# EAGLE design MCC8 (EAGLE 6.4)
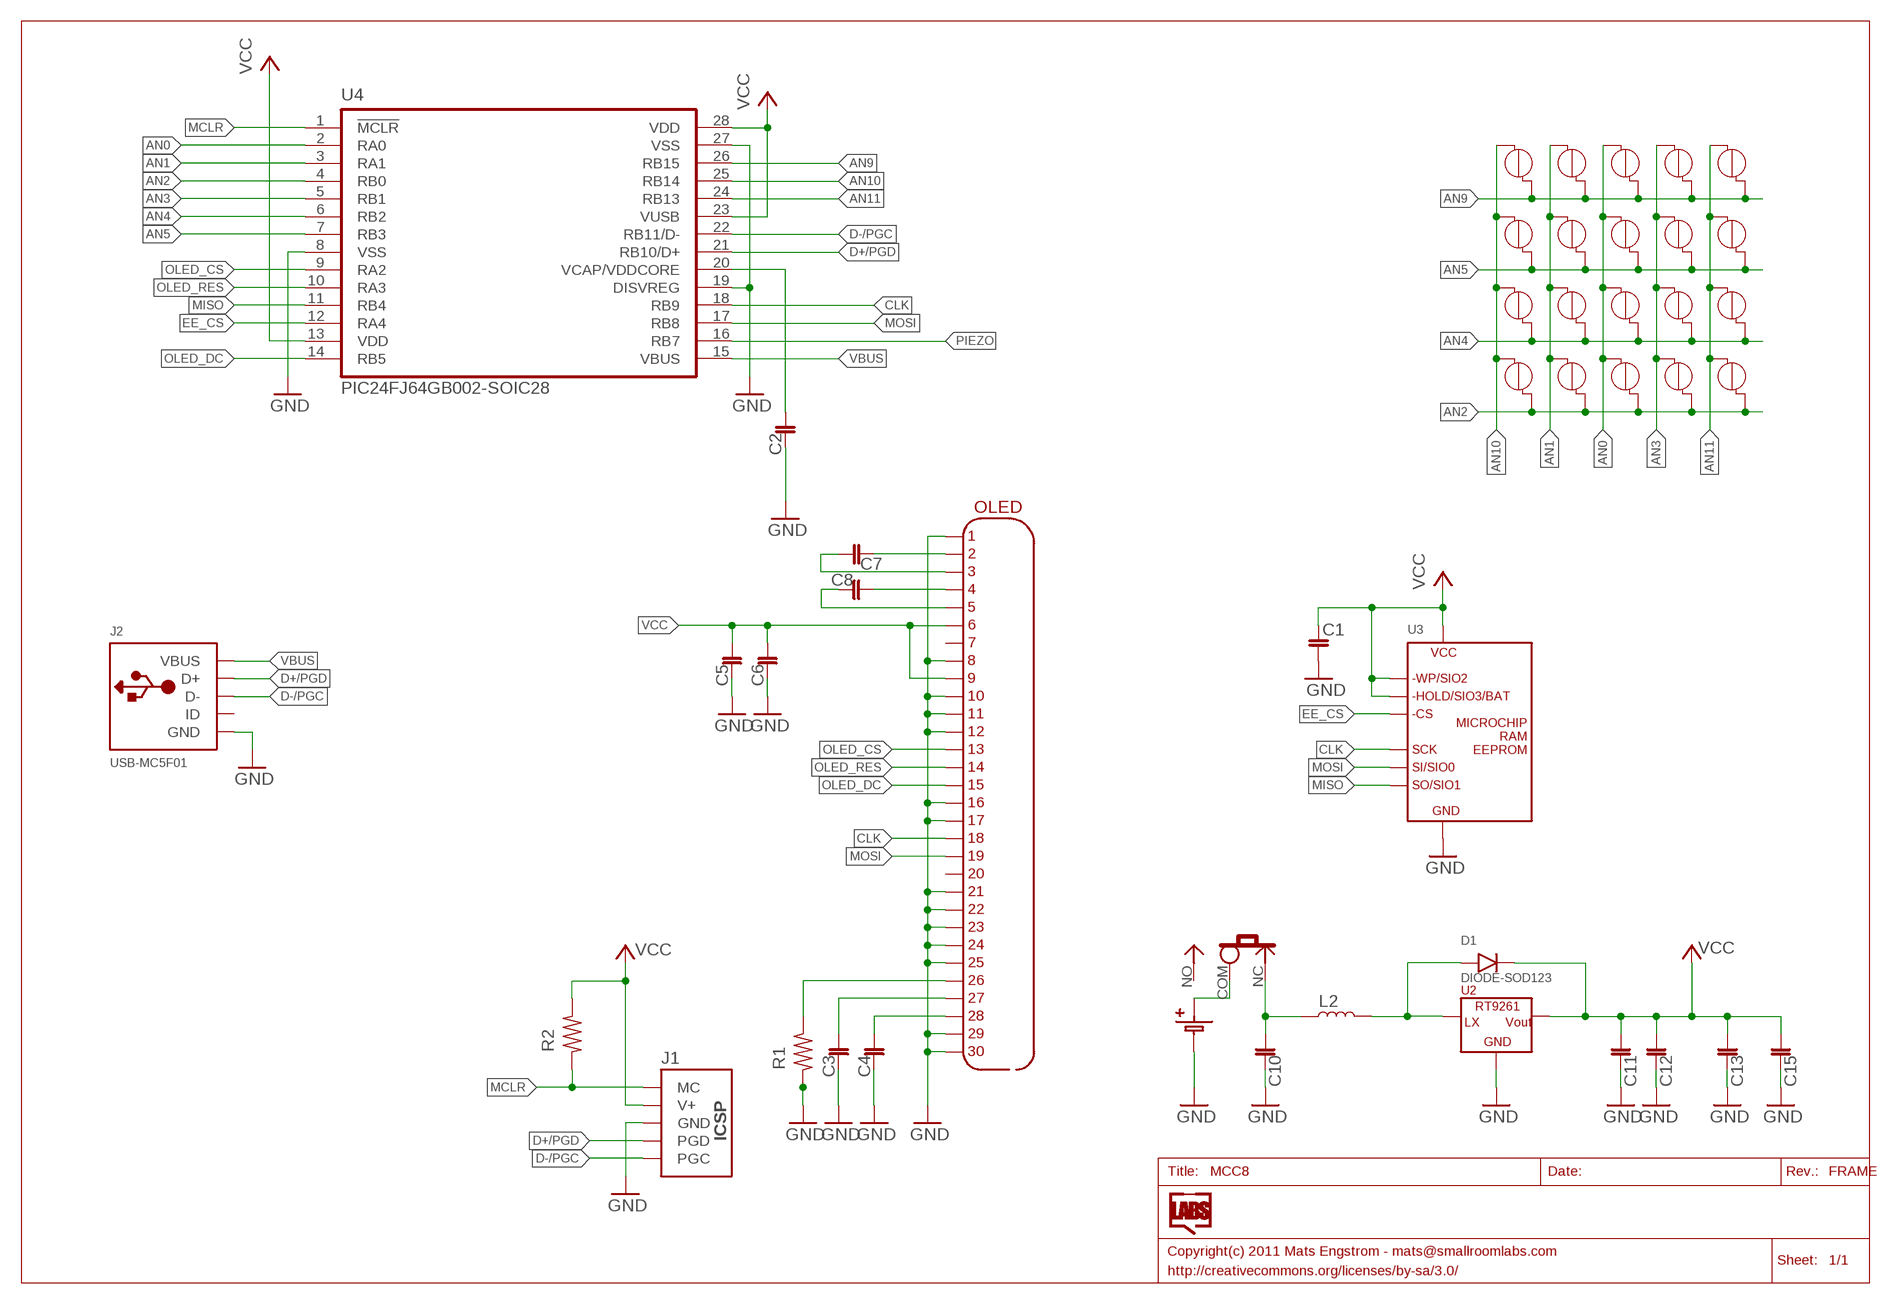
[diagram p0: schematic, sheet 1]

## Parts
B1  TOUCH-CAP2-7  [TOUCH-CAP2-7MM]
B2  TOUCH-CAP2-7  [TOUCH-CAP2-7MM]
B3  TOUCH-CAP2-7  [TOUCH-CAP2-7MM]
B4  TOUCH-CAP2-7  [TOUCH-CAP2-7MM]
B5  TOUCH-CAP2-7  [TOUCH-CAP2-7MM]
B6  TOUCH-CAP2-7  [TOUCH-CAP2-7MM]
B7  TOUCH-CAP2-7  [TOUCH-CAP2-7MM]
B8  TOUCH-CAP2-7  [TOUCH-CAP2-7MM]
B9  TOUCH-CAP2-7  [TOUCH-CAP2-7MM]
B10  TOUCH-CAP2-7  [TOUCH-CAP2-7MM]
B11  TOUCH-CAP2-7  [TOUCH-CAP2-7MM]
B12  TOUCH-CAP2-7  [TOUCH-CAP2-7MM]
B13  TOUCH-CAP2-7  [TOUCH-CAP2-7MM]
B14  TOUCH-CAP2-7  [TOUCH-CAP2-7MM]
B15  TOUCH-CAP2-7  [TOUCH-CAP2-7MM]
B16  TOUCH-CAP2-7  [TOUCH-CAP2-7MM]
B17  TOUCH-CAP2-7  [TOUCH-CAP2-7MM]
B18  TOUCH-CAP2-7  [TOUCH-CAP2-7MM]
B19  TOUCH-CAP2-7  [TOUCH-CAP2-7MM]
B20  TOUCH-CAP2-7  [TOUCH-CAP2-7MM]
BA2  BATTERY2-AAA1  [BAT-AAA1]
C1  C-0805  [C0805]
C2  C-0805  [C0805]
C3  C-0805  [C0805]
C4  C-0805  [C0805]
C5  C-0805  [C0805]
C6  C-0805  [C0805]
C7  C-0805  [C0805]
C8  C-0805  [C0805]
C10  C-0805  [C0805]
C11  C-0805  [C0805]
C12  C-0805  [C0805]
C13  C-0805  [C0805]
C15  C-0805  [C0805]
D1  DIODE-SOD123  [SOD123]
J1  ICSP-SMD-B  [ICSP-SMD-B]
J2  USB-MC5F01  [USB-MICRO-MC5F01]
L2  L-BOURNS-SRP7030  [IND-BOURNS-SRP7030]
R1  R-0805  [R0805]
R2  R-0805  [R0805]
SW1  SLIDE1-PCM12  [SW-PCM12]
U2  RT9261-SOT89  [SOT89]
U3  MICROCHIP-SERIALMEM8  [SO08]
U4  PIC24FJ64GB002-SOIC28  [SO28W]
U$2  OLED30-A  [OLED128X64]

## Nets
AN0: B9.P$1 B10.P$1 B11.P$1 B12.P$1 U4.2(RA0)
AN1: B5.P$1 B6.P$1 B7.P$1 B8.P$1 U4.3(RA1)
AN2: B4.P$2 B8.P$2 B12.P$2 B16.P$2 B20.P$2 U4.4(RB0)
AN3: B13.P$1 B14.P$1 B15.P$1 B16.P$1 U4.5(RB1)
AN4: B3.P$2 B7.P$2 B11.P$2 B15.P$2 B19.P$2 U4.6(RB2)
AN5: B2.P$2 B6.P$2 B10.P$2 B14.P$2 B18.P$2 U4.7(RB3)
AN9: B1.P$2 B5.P$2 B9.P$2 B13.P$2 B17.P$2 U4.26(RB15)
AN10: B1.P$1 B2.P$1 B3.P$1 B4.P$1 U4.25(RB14)
AN11: B17.P$1 B18.P$1 B19.P$1 B20.P$1 U4.24(RB13)
BAT: BA2.PLUS(POS1) SW1.COM
BAT-SWITCHED: C10.1 L2.P$1 SW1.NC
CLK: U3.6(SCK) U4.18(RB9) U$2.P$18
D+/PGD: J1.PGD J2.P3(D+) U4.21(RB10/D+)
D-/PGC: J1.PGC J2.P2(D-) U4.22(RB11/D-)
EE_CS: U3.1(CS) U4.12(RA4)
GND: BA2.MINUS(NEG) C1.2 C2.2 C3.2 C4.2 C5.2 C6.2 C10.2 C11.2 C12.2 C13.2 C15.2 J1.GND J2.P5(GND) R1.1 U2.1(GND) U3.4(GROUND) U4.8(VSS) U4.19(DISVREG) U4.27(VSS) U$2.P$1 U$2.P$8 U$2.P$10 U$2.P$11 U$2.P$12 U$2.P$16 U$2.P$17 U$2.P$21 U$2.P$22 U$2.P$23 U$2.P$24 U$2.P$25 U$2.P$29 U$2.P$30
LX: D1.A L2.P$2 U2.3(LX)
MCLR: J1.VPP(MC) R2.1 U4.1(!MCLR)
MISO: U3.2(SO) U4.11(RB4)
MOSI: U3.5(SI) U4.17(RB8) U$2.P$19
N$1: C4.1 U$2.P$28
N$10: C3.1 U$2.P$27
N$11: R1.2 U$2.P$26
N$12: C7.2 U$2.P$2
N$13: C7.1 U$2.P$3
N$14: C8.1 U$2.P$4
N$15: C8.2 U$2.P$5
OLED_CS: U4.9(RA2) U$2.P$13
OLED_DC: U4.14(RB5) U$2.P$15
OLED_RES: U4.10(RA3) U$2.P$14
PIEZO: U4.16(RB7)
VBUS: J2.P1(VBUS) U4.15(VBUS)
VCC: C1.1 C5.1 C6.1 C11.1 C12.1 C13.1 C15.1 D1.C J1.V+ R2.2 U2.2(VOUT) U2.2@1(VOUT) U3.3(WP) U3.7(HOLD) U3.8(POW) U4.13(VDD) U4.23(VUSB) U4.28(VDD) U$2.P$6 U$2.P$9
VDDCORE: C2.1 U4.20(VCAP/VDDCORE)
Unconnected: J2.P4(ID) SW1.NO U$2.P$7 U$2.P$20

## Library data of the parts
B1-B20 = SRL:TOUCH-CAP2
BA2 = SRL:BATTERY2
C1-C8 C10-C13 C15 = SRL:C: Not verified
D1 = SRL:DIODE
J1 = SRL:ICSP
J2 = SRL:USB
L2 = SRL:L: Not verified
R1 R2 = SRL:R: Not Verified
SW1 = SRL:SLIDE1
U2 = SRL:RT9261
U3 = SRL:MICROCHIP-SERIALMEM8
U4 = SRL:PIC24FJ64GB002
U$2 = SRL:OLED30

## Board
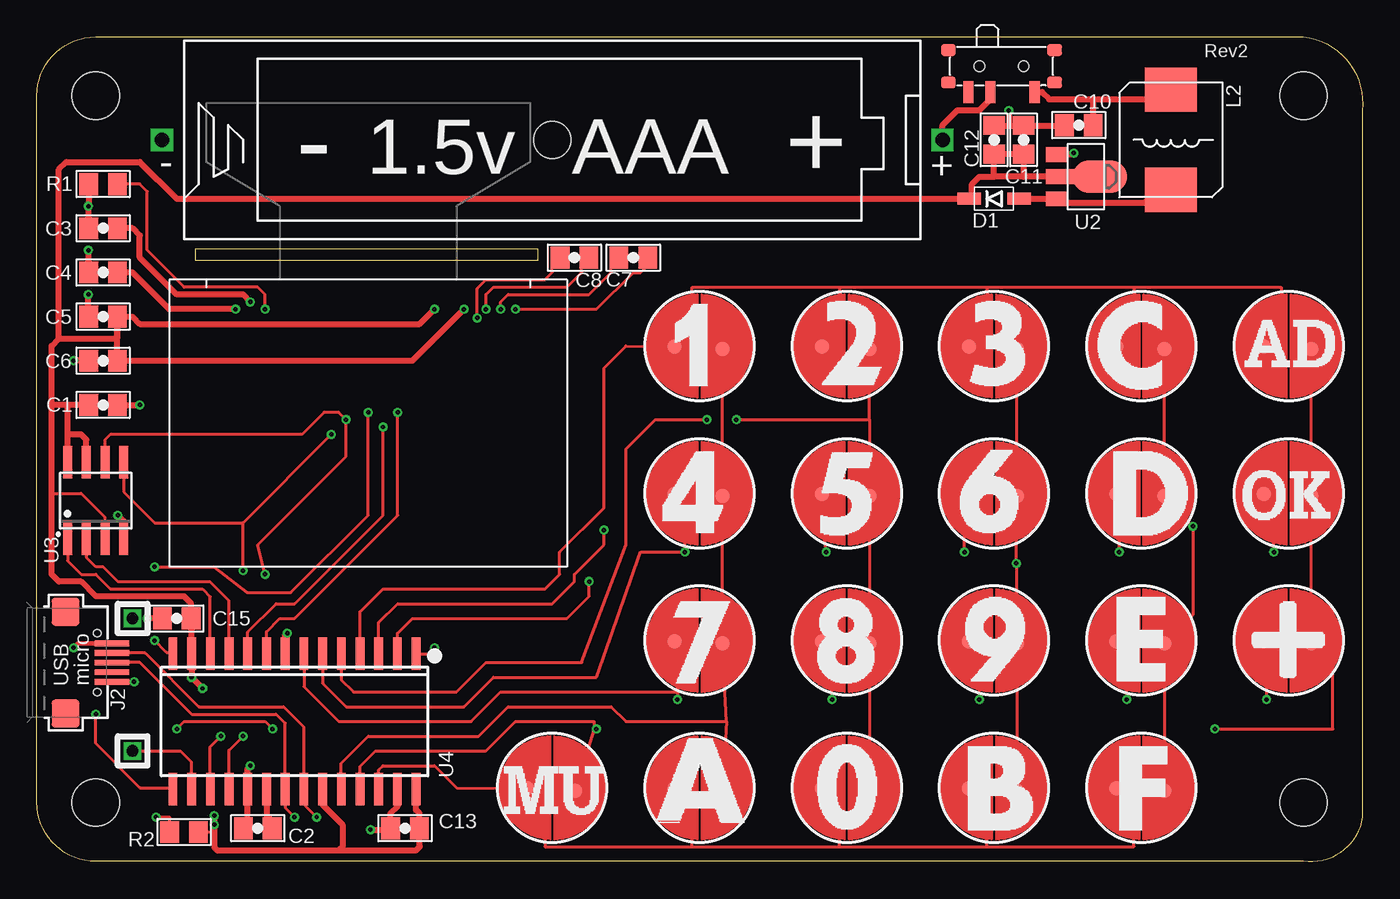
[diagram p1: board, top side]
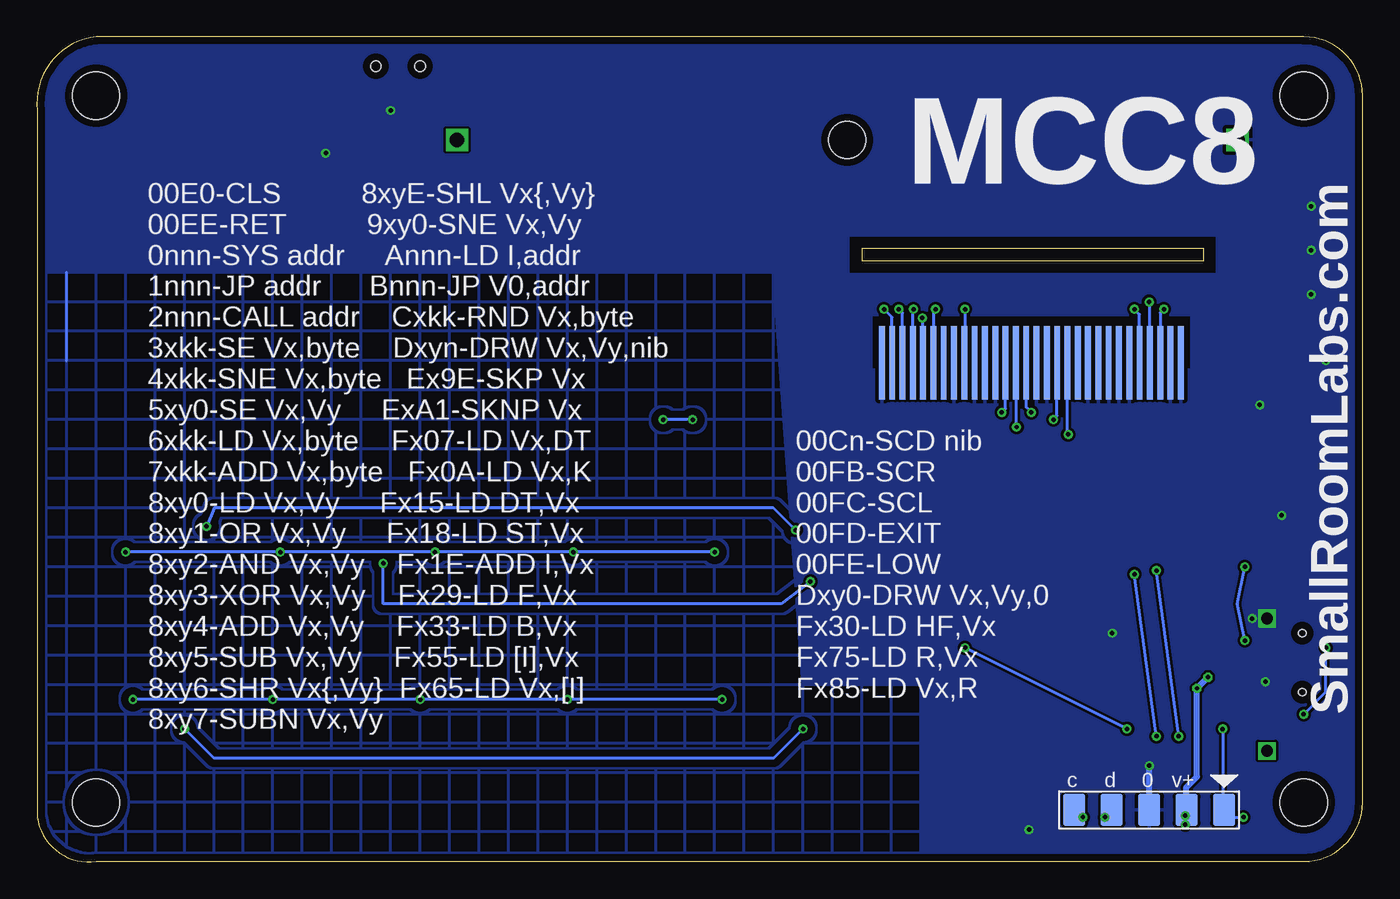
[diagram p2: board, bottom side, seen from below]

Size 90.03 x 56.03 mm. Coordinates in mm from the lower left corner, seen from the top.
Outline: 90,3.03 arc-90 86,0.03 4,0.03 arc-90 0,4.03 0,52.03 arc-90 4,56.03 86,56.03 arc-90 90,51.03 90,3.03
Copper layers (1*16): Top 0.035mm / dielectric 1.5mm / Bottom 0.035mm
Design rules "SmartPrototyping": minimum track width 7mil, minimum drill 12mil, track to track 7mil, track to pad 7mil, pad to pad 7mil, via to via 7mil, smd to smd 0mil, copper to edge 20mil, drill to drill 10mil, minimum pad ring 10mil, minimum via ring 6mil, stop-mask expansion 2mil, vias tented up to drill 25mil, thermal gap 10mil
Holes 3.2 mm at 86,4.03 4,52.03 86,52.03 4,4.03
tKeepout: area 10,40 to 34.8,42.4
bKeepout: area 10,40 to 34.8,42.4
tRestrict: area 10,40 to 34.8,42.4
bRestrict: area 10,40 to 34.8,42.4; area 11.8,33.5 to 33.2,37
Milling: 4 lines

### Footprints (pad centres in the part's own frame; a part is rotated, then mirrored left to right if it is on the bottom)
TOUCH-CAP2-7MM = smd 1 x 1: P$1 -1.55,0.2; P$2 1.7,0.05
BAT-AAA1 = drill 1 square: MINUS 26.5,0; PLUS -26.5,0 | hole 2.5: 0,0
C0805 = smd 1.27 x 1.473: 1 -0.975,0; 2 0.975,0
SOD123 = smd 1.6 x 0.8: A 1.7,0; C -1.7,0
ICSP-SMD-B = smd 1.5 x 2.2: GND 0,0; PGC 5.08,0; PGD 2.54,0; V+ -2.54,0; VPP -5.08,0
USB-MICRO-MC5F01 = smd 0.4 x 2.35: P1 -1.3,4.6; P2 -0.65,4.6; P3 0,4.6; P4 0.65,4.6; P5 1.3,4.6 | smd 1.9 x 1.9: P$1 -3.45,1.45; P$2 3.45,1.45 | hole 0.5: -2,3.6; 2,3.6
IND-BOURNS-SRP7030 = smd 3 x 3.5: P$1 -3.4,0; P$2 3.4,0
R0805 = smd 1.27 x 1.473: 1 -0.975,0; 2 0.975,0
SW-PCM12 = smd 0.7 x 1.5: COM 0.75,1.75; NC -2.25,1.75; NO 2.25,1.75 | smd 1 x 0.8: P$1 -3.6,-1.1; P$2 -3.6,1.1; P$3 3.6,1.1; P$4 3.6,-1.1 | hole 0.7: -1.5,0; 1.5,0
SOT89 = smd 1 x 1.5: 1 -1.499,-1.981; 3 1.499,-1.981 | smd 1 x 2: 2 0,-1.727 | smd 2.2 x 3.7: 2@1 0,0.94
SO08 = smd 0.6 x 2.2: 1 -1.905,-2.6; 2 -0.635,-2.6; 3 0.635,-2.6; 4 1.905,-2.6; 5 1.905,2.6; 6 0.635,2.6; 7 -0.635,2.6; 8 -1.905,2.6
SO28W = smd 0.6 x 2.2: 1 -8.255,-4.6; 2 -6.985,-4.6; 3 -5.715,-4.6; 4 -4.445,-4.6; 5 -3.175,-4.6; 6 -1.905,-4.6; 7 -0.635,-4.6; 8 0.635,-4.6; 9 1.905,-4.6; 10 3.175,-4.6; 11 4.445,-4.6; 12 5.715,-4.6; 13 6.985,-4.6; 14 8.255,-4.6; 15 8.255,4.6; 16 6.985,4.6; 17 5.715,4.6; 18 4.445,4.6; 19 3.175,4.6; 20 1.905,4.6; 21 0.635,4.6; 22 -0.635,4.6; 23 -1.905,4.6; 24 -3.175,4.6; 25 -4.445,4.6; 26 -5.715,4.6; 27 -6.985,4.6; 28 -8.255,4.6
OLED128X64 = smd 0.4 x 5 bottom: P$1 -10.15,17.65; P$2 -9.45,17.65; P$3 -8.75,17.65; P$4 -8.05,17.65; P$5 -7.35,17.65; P$6 -6.65,17.65; P$7 -5.95,17.65; P$8 -5.25,17.65; P$9 -4.55,17.65; P$10 -3.85,17.65; P$11 -3.15,17.65; P$12 -2.45,17.65; P$13 -1.75,17.65; P$14 -1.05,17.65; P$15 -0.35,17.65; P$16 0.35,17.65; P$17 1.05,17.65; P$18 1.75,17.65; P$19 2.45,17.65; P$20 3.15,17.65; P$21 3.85,17.65; P$22 4.55,17.65; P$23 5.25,17.65; P$24 5.95,17.65; P$25 6.65,17.65; P$26 7.35,17.65; P$27 8.05,17.65; P$28 8.75,17.65; P$29 9.45,17.65; P$30 10.15,17.65

### Placement (x,y rotation side)
B1  35,5.03 180 top
B2  85,15.03 180 top
B3  85,25.03 180 top
B4  85,35.03 180 top
B5  75,5.03 180 top
B6  75,15.03 180 top
B7  75,25.03 180 top
B8  75,35.03 180 top
B9  65,5.03 180 top
B10  65,15.03 180 top
B11  65,25.03 180 top
B12  65,35.03 180 top
B13  55,5.03 180 top
B14  55,15.03 180 top
B15  55,25.03 180 top
B16  55,35.03 180 top
B17  45,5.03 180 top
B18  45,15.03 180 top
B19  45,25.03 180 top
B20  45,35.03 180 top
BA2  35,49.03 180 top
C1  4.5,31.03 0 top
C2  15,2.28 180 top
C3  4.5,43.03 180 top
C4  4.5,40.03 180 top
C5  4.5,37.03 180 top
C6  4.5,34.03 180 top
C7  40.5,41.03 0 top
C8  36.5,41.03 180 top
C10  70.75,50.03 180 top
C11  67,49.03 90 top
C12  65,49.03 90 top
C13  25,2.28 180 top
C15  9.5,16.53 180 top
D1  65,45.03 0 top
J1  14.5,3.53 180 bottom
J2  0.5,13.53 270 top
L2  77,49.03 270 top
R1  4.5,46.03 0 top
R2  10,2.03 0 top
SW1  65.5,54.03 180 top
U2  71.25,46.53 270 top
U3  4,24.53 0 top
U4  17.5,9.53 180 top
U$2  22.5,51.53 180 top

### Tracks (layer width: path | path; a pad name or v marks a point on that pad's centre or on a via)
AN0  (via drill 0.3)
  Top 0.203: B12.P$1 B11.P$1 v66.5,20.28 B10.P$1 B9.P$1 | v37.5,19.03 37.5,18.03 36,16.53 25.5,16.53 24.48,15.52 U4.2
  Bottom 0.203: v37.5,19.03 39.5,17.53 66.5,17.53 v66.5,20.28
AN1  (via drill 0.3)
  Top 0.203: B5.P$1 B6.P$1 78.5,16.78 v78.5,22.78 B7.P$1 B8.P$1 | v38.5,22.53 38.5,21.53 36.5,19.53 36.5,19.03 35,17.53 24.5,17.53 23.21,16.25 U4.3
  Bottom 0.203: v78.5,22.78 78,24.03 40,24.03 v38.5,22.53
AN2
  Top 0.203: 54.5,39.03 44.5,39.03 44.5,35.03 B20.P$2 40,35.03 38.5,33.53 38.5,24.03 35.5,21.03 35.5,19.53 34.5,18.53 23.5,18.53 21.95,16.98 U4.4 | 54.5,39.03 64.5,39.03 | 64.5,39.03 74.5,39.03 | 74.5,39.03 84.5,39.03 84.5,35.03 B4.P$2 | B8.P$2 74.5,35.03 74.5,39.03 | B12.P$2 64.5,35.03 64.5,39.03 | B16.P$2 54.5,35.03 54.5,39.03
AN3  (via drill 0.3)
  Top 0.203: 56.55,30.03 B15.P$1 B14.P$1 B13.P$1 | 56.55,30.03 B16.P$1 | v45.5,30.03 42,30.03 40,28.03 40,21.53 37,13.53 30.5,13.53 28.5,11.53 21.5,11.53 20.68,12.36 U4.5 | v47.5,30.03 56.55,30.03
  Bottom 0.203: v45.5,30.03 v47.5,30.03
AN4  (via drill 0.3)
  Top 0.203: B3.P$2 84,25.03 v84,21.03 | v73.5,21.03 73.5,25.03 B7.P$2 | B19.P$2 44,25.03 v44,21.03 41,21.03 38,12.53 31,12.53 29,10.53 21,10.53 19.41,12.13 U4.6 | B11.P$2 63,25.03 v63,21.03 | B15.P$2 53,25.03 v53.6,21.03
  Bottom 0.203: v84,21.03 v73.5,21.03 v63,21.03 v53.6,21.03 v44,21.03
AN5  (via drill 0.3)
  Top 0.203: B2.P$2 83.5,15.03 v83.5,11.03 | v74,11.03 74,15.03 B6.P$2 | B10.P$2 64,15.03 v64,11.03 | B14.P$2 54,15.03 v54,11.03 | B18.P$2 43.5,15.03 43.5,11.53 | 43.5,11.53 v43.5,11.03 | 43.5,11.53 31.5,11.53 29.5,9.53 20.5,9.53 18.14,11.9 U4.7
  Bottom 0.203: v83.5,11.03 v74,11.03 v64,11.03 v54,11.03 v43.5,11.03
AN9
  Top 0.203: B5.P$2 74.5,5.03 74.5,1.03 64.5,1.03 | 44.5,1.03 54.5,1.03 | 54.5,1.03 64.5,1.03 | 44.5,1.03 44.5,5.03 B17.P$2 | B13.P$2 54.5,5.03 54.5,1.03 | B9.P$2 64.5,5.03 64.5,1.03 | 44.5,1.03 34.5,1.03 34.5,5.03 B1.P$2 28.5,5.03 27,6.53 23.5,6.53 23.21,6.25 U4.26
AN10  (via drill 0.3)
  Top 0.203: B4.P$1 B3.P$1 B2.P$1 88,15.03 88,9.03 v80,9.03 | 37.84,9.03 37.84,9.53 32.5,9.53 30.5,7.53 23,7.53 21.95,6.48 U4.25 | 37.84,9.03 B1.P$1 | 37.84,9.03 v38,9.03
  Bottom 0.203: v38,9.03 40,7.03 78,7.03 v80,9.03
AN11
  Top 0.203: B20.P$1 B19.P$1 B18.P$1 46.84,9.53 | 46.84,9.53 B17.P$1 | 46.84,9.53 40,9.53 39,10.53 32,10.53 30,8.53 22.5,8.53 20.68,6.71 U4.24
BAT
  Top 0.406: BA2.PLUS 61.5,50.03 62.5,51.03 64,51.03 64.75,51.78 SW1.COM
BAT-SWITCHED
  Top 0.406: SW1.NC 68.25,52.28 68.75,51.78 71.75,51.78 | 71.75,51.78 76.35,51.78 L2.P$1 | C10.1 71.72,51.76 71.75,51.78
CLK  (via drill 0.3)
  Top 0.203: v15.5,19.53 15,21.53 21,27.53 v21,30.03 20.5,30.53 19.5,30.53 18,29.03 5,29.03 4.63,28.67 U3.6 | U4.18 13.05,7.59 v14,8.53
  Bottom 0.203: U$2.P$18 20.75,30.28 v21,30.03 | v14,8.53 v15.5,19.53
D+/PGD  (via drill 0.3)
  Top 0.203: J2.P3 7,13.53 10.5,10.03 16.25,10.03 16.86,9.42 U4.21 16.86,3.67 v17.5,3.03
  Bottom 0.203: v17.5,3.03 17,3.57 J1.PGD
D-/PGC  (via drill 0.3)
  Top 0.203: v19,3.03 18.27,3.76 18.27,4.8 U4.22 18.14,9.15 16.75,10.53 11,10.53 7.35,14.18 J2.P2
  Bottom 0.203: v19,3.03 J1.PGC
EE_CS
  Top 0.203: U3.1 2.1,20.44 3,19.53 4,19.53 5,18.53 11.25,18.53 11.79,18 U4.12
GND  (via drill 0.3, 0.8)
  Top 0.305: J2.P5 v6.6,12.23
  Top 0.406: 5.66,23.38 v5.5,23.53 5.91,23.13 U3.4 | C5.2 v3.5,38.53 | C6.2 v2.5,34.03 | C15.2 v7.5,16.53 | v22.65,2.18 23.82,2.18 C13.2 24,2.31 24,3.28 24.48,3.77 U4.27 | 64.97,50.03 C12.2 66,50.01 | 66,50.01 C11.2 69.75,50.01 C10.2 | v66,51.03 66,50.01 | v70.4,48.13 70.3,48.03 U2.1 | C1.2 v7,31.03 | C4.2 3.52,41.51 v3.5,41.53 | C3.2 3.52,44.51 v3.5,44.53 3.52,44.56 R1.1 | U4.8 16.86,15.4 v17,15.53 | v14.5,6.53 14.32,6.36 U4.19 14.32,2.58 C2.2
  Bottom 0.203: 88,34.03 88,40.03
  Bottom 0.406: J1.GND v14.5,6.53
  other vias: 6.5,16.53
  pour Bottom (isolate 0.5, hatched): 30,0.03 30,12.03 38,12.03 40,40.03 90,40.03 90,0.03
  pour Bottom: 0,0.03 30,0.03 30,12.03 38,12.03 40,40.03 90,40.03 90,56.03 0,56.03
LX
  Top 0.406: 66.5,45.03 D1.A 66.85,45.03 U2.3 69.52,44.78 75.25,44.78 75.5,45.03 76.4,45.03 L2.P$2
MCLR  (via drill 0.3)
  Top 0.203: 26.7,14.23 v27,14.53 26.6,14.13 U4.1 | v16,9.03 15.5,9.53 10,9.53 v9.5,9.03 | R2.1 9.03,3.01 9,3.03 v8.1,3.03
  Bottom 0.203: v16,9.03 v27,14.53 | v9.5,9.03 9.5,3.61 J1.VPP 8.92,3.03 v8.1,3.03
MISO
  Top 0.203: U3.2 3.37,20.67 4,20.03 4.5,20.03 5.5,19.03 11.75,19.03 13.05,17.73 U4.11
MOSI  (via drill 0.3)
  Top 0.203: v14,19.78 14,23.03 | 14,23.03 v20,29.03 | U3.5 5.91,25.13 8,23.03 14,23.03 | U4.17 11.79,7.82 v12.5,8.53
  Bottom 0.203: U$2.P$19 20.05,29.08 v20,29.03 | v12.5,8.53 v14,19.78
N$1  (via drill 0.3)
  Top 0.406: v13.5,37.53 9,37.53 6.5,40.03 C4.1
  Bottom 0.203: U$2.P$28 13.75,37.28 v13.5,37.53
N$10  (via drill 0.3)
  Top 0.406: v14.5,38.03 14,38.53 9.5,38.53 7,41.03 7,42.53 6.5,43.03 C3.1
  Bottom 0.203: U$2.P$27 14.45,37.98 v14.5,38.03
N$11  (via drill 0.3)
  Top 0.203: v15.5,37.53 15.5,38.53 15,39.03 10,39.03 7.5,41.53 7.5,45.53 7,46.03 R1.2
  Bottom 0.203: U$2.P$26 15.15,37.18 v15.5,37.53
N$12  (via drill 0.3)
  Top 0.203: v32.5,37.53 38,37.53 40.5,40.03 41,40.03 41.5,40.53 41.5,41.01 C7.2
  Bottom 0.203: U$2.P$2 31.95,36.98 v32.5,37.53
N$13  (via drill 0.3)
  Top 0.203: v31.5,37.53 31.5,38.03 32,38.53 37.5,38.53 39,40.03 39,40.51 C7.1
  Bottom 0.203: U$2.P$3 31.25,37.28 v31.5,37.53
N$14  (via drill 0.3)
  Top 0.203: v30.5,37.53 30.5,38.53 31,39.03 36,39.03 37,40.03 37,40.56 C8.1
  Bottom 0.203: U$2.P$4 30.55,37.48 v30.5,37.53
N$15  (via drill 0.3)
  Top 0.203: v29.9,36.93 29.9,38.93 30.5,39.53 34.5,39.53 35,40.03 35,40.51 C8.2
  Bottom 0.203: U$2.P$5 29.85,36.88 v29.9,36.93
OLED_CS  (via drill 0.3)
  Top 0.203: v24.5,30.53 24.5,23.53 17.5,16.53 16.5,16.53 15.6,15.63 U4.9
  Bottom 0.203: U$2.P$13 24.25,30.78 v24.5,30.53
OLED_DC  (via drill 0.3)
  Top 0.203: v8,15.03 8.8,14.23 9.14,14.23 U4.14 | v8,20.03 12,20.03 14.25,18.28 17.25,18.28 22.5,23.53 v22.5,30.53
  Bottom 0.203: U$2.P$15 22.85,30.88 v22.5,30.53 | v8,15.03 8.5,17.53 v8,20.03
OLED_RES  (via drill 0.3)
  Top 0.203: v23.5,29.53 23.5,23.53 17.5,17.53 16.25,17.53 14.32,15.61 U4.10
  Bottom 0.203: v23.5,29.53 23.5,33.83 U$2.P$14
PIEZO  (via drill 0.8)
  Top 0.203: v6.5,7.53 9.75,7.53 10.52,6.77 U4.16
VBUS  (via drill 0.3)
  Top 0.203: v4,10.03 4,8.03 7,5.03 9.14,5.03 U4.15
  Top 0.305: J2.P1 2.8,14.83 v2.5,14.53
  Bottom 0.203: v2.5,14.53 2.5,11.53 v4,10.03
VCC  (via drill 0.3)
  Top 0.203: 1,25.03 3,25.03 4.63,23.4 U3.3 | R2.2 12.05,2.03
  Top 0.406: 1.5,35.53 1.5,47.03 2,47.53 7,47.53 9.5,45.03 D1.C 63.5,45.38 63.5,46.03 64,46.53 65,46.53 | 20.5,0.78 12.25,0.78 12.05,0.98 12.05,2.03 v12.05,3.13 | 20.5,0.78 25.75,0.78 26,1.03 26,2.26 C13.1 25.98,3.31 25.75,3.53 U4.28 | 1.5,35.53 5.45,35.53 | 1,31.03 1,25.03 1,19.53 1.5,19.03 3,19.03 4,18.03 10,18.03 10.45,17.58 10.45,17.53 10.47,17.51 C15.1 | 1,31.03 1,35.03 1.5,35.53 | C1.1 2,31.03 | 2,31.03 1,31.03 | C5.1 5.47,37.56 5.45,35.53 | C5.1 C6.1 25.5,34.03 v29,37.53 | C5.1 5.47,37.51 5.45,35.53 | 10.65,16.36 C15.1 | 65,46.53 C12.1 C11.1 67,46.53 | U3.8 2.1,29.03 | U3.7 3.37,28.67 3,29.03 2.1,29.03 | 67,46.53 65,46.53 | 67,46.53 U2.2 U2.2@1 | C5.1 6.5,37.03 7,36.53 26,36.53 v27,37.53 | 2.1,29.03 2.1,30.94 2,31.03 | C15.1 10.52,16.49 U4.13 10.52,12.52 v11.25,11.78 | U4.23 19.41,3.88 20.75,2.53 20.75,1.03 20.5,0.78
  Bottom 0.203: U$2.P$6 29.15,37.38 v29,37.53 | v27,37.53 27,33.83 U$2.P$9 | v12.05,3.13 J1.V+
  Bottom 0.406: J1.V+ 12,3.57 12,5.03 11.25,5.78 v11.25,11.78 v10.5,12.53 | v12.05,3.13 v12.05,2.53
VDDCORE
  Top 0.203: 15.73,2.28 C2.1
  Top 0.406: U4.20 15.6,3.19 15.75,3.03 15.75,2.26 C2.1

### Text on the board
tPlace: Rev2
bPlace: MCC8 | SmallRoomLabs.com | 00Cn-SCD nib / 00FB-SCR / 00FC-SCL / 00FD-EXIT / 00FE-LOW / Dxy0-DRW Vx,Vy,0 / Fx30-LD HF,Vx / Fx75-LD R,Vx / Fx85-LD Vx,R | 00E0-CLS 8xyE-SHL Vx{,Vy} / 00EE-RET 9xy0-SNE Vx,Vy / 0nnn-SYS addr Annn-LD I,addr / 1nnn-JP addr Bnnn-JP V0,addr / 2nnn-CALL addr Cxkk-RND Vx,byte / 3xkk-SE Vx,byte Dxyn-DRW Vx,Vy,nib / 4xkk-SNE Vx,byte Ex9E-SKP Vx / 5xy0-SE Vx,Vy ExA1-SKNP Vx / 6xkk-LD Vx,byte Fx07-LD Vx,DT / 7xkk-ADD Vx,byte Fx0A-LD Vx,K / 8xy0-LD Vx,Vy Fx15-LD DT,Vx / 8xy1-OR Vx,Vy Fx18-LD ST,Vx / 8xy2-AND Vx,Vy Fx1E-ADD I,Vx / 8xy3-XOR Vx,Vy Fx29-LD F,Vx / 8xy4-ADD Vx,Vy Fx33-LD B,Vx / 8xy5-SUB Vx,Vy Fx55-LD [I],Vx / 8xy6-SHR Vx{,Vy} Fx65-LD Vx,[I] / 8xy7-SUBN Vx,Vy